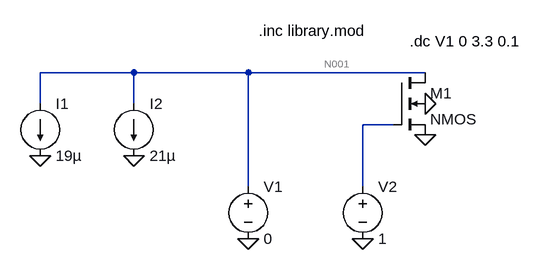
[diagram p0: schematic Draft4.asc]
Draft4.asc, the LTspice schematic file:
Version 4
SHEET 1 880 680
WIRE -176 112 -320 112
WIRE 0 112 -176 112
WIRE 272 112 0 112
WIRE -320 160 -320 112
WIRE -176 160 -176 112
WIRE 224 192 176 192
WIRE 0 288 0 112
WIRE 176 288 176 192
FLAG 272 160 0
FLAG 272 208 0
FLAG -320 240 0
FLAG -176 240 0
FLAG 0 368 0
FLAG 176 368 0
SYMBOL nmos4 224 112 R0
SYMATTR InstName M1
SYMATTR Value2 l=21.3u w=25.5u
SYMBOL voltage 0 272 R0
WINDOW 123 0 0 Left 0
WINDOW 39 0 0 Left 0
SYMATTR InstName V1
SYMATTR Value 0
SYMBOL voltage 176 272 R0
WINDOW 123 0 0 Left 0
WINDOW 39 0 0 Left 0
SYMATTR InstName V2
SYMATTR Value 1
SYMBOL current -320 160 R0
WINDOW 123 0 0 Left 0
WINDOW 39 0 0 Left 0
SYMATTR InstName I1
SYMATTR Value 19µ
SYMBOL current -176 160 R0
WINDOW 123 0 0 Left 0
WINDOW 39 0 0 Left 0
SYMATTR InstName I2
SYMATTR Value 21µ
TEXT 16 48 Left 2 !.inc library.mod
TEXT 248 64 Left 2 !.dc V1 0 3.3 0.1

The netlist it stands for:
* Draft4.asc
M1 N001 N002 0 0 NMOS l=21.3u w=25.5u
V1 N001 0 0
V2 N002 0 1
I1 N001 0 19µ
I2 N001 0 21µ
.model NMOS NMOS
.model PMOS PMOS
.lib standard.mos
.inc library.mod
.dc V1 0 3.3 0.1
.backanno
.end

* Results of the author's LTspice run, read from the files saved beside the schematic
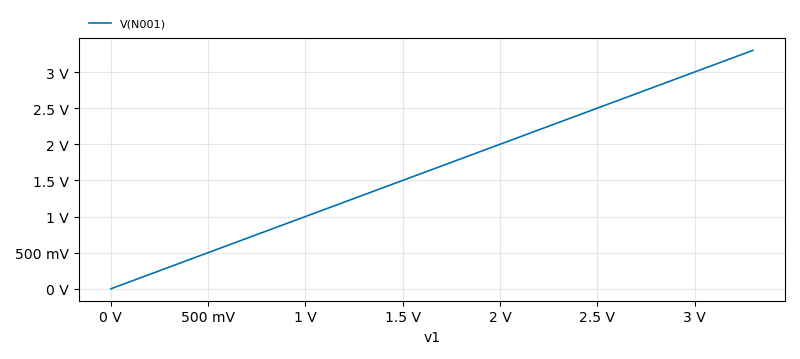
[diagram p1: DC transfer characteristic of Draft4.asc, plotted from the saved traces]
* DC transfer characteristic, 1 run:
*   V(N001): 0 V at v1=0 V, 3.3 V at v1=3.3 V, min 0 V, max 3.3 V